# Altium schematic sheet STM32_SWD.SchDoc
size A4
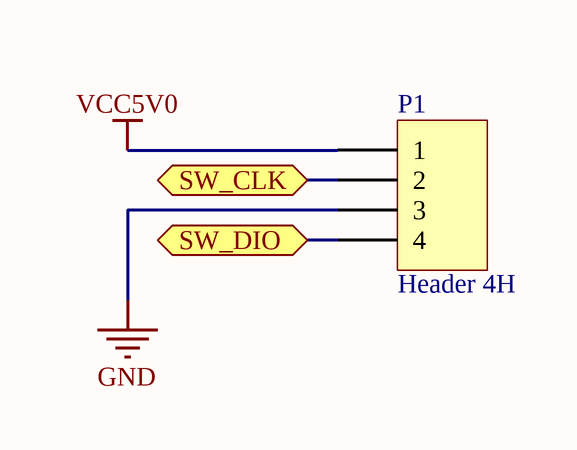
[diagram p0: STM32_SWD.SchDoc]

## Parts
P1  Header 4H  [HDR1X4H]

## Ports
SW_CLK, SW_DIO

## Nets
GND: P1.3
VCC5V0: P1.1
SW_CLK: P1.2 ; port SW_CLK
SW_DIO: P1.4 ; port SW_DIO

## Library data of the parts
P1 = Header 4H: Header, 4-Pin, Right Angle; LatestRevisionDate: 17-Jul-2002; LatestRevisionNote: Re-released for DXP Platform.; Publisher: Altium Limited